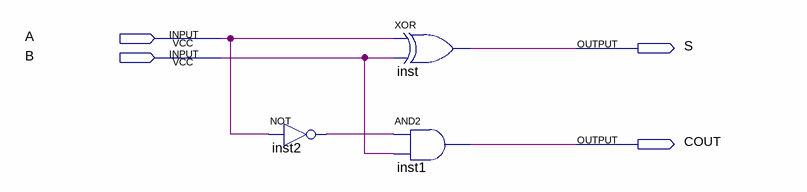
[diagram p0: schematic sheet]
// Quartus schematic MeioSubtrator.bdf as structural Verilog: 3 symbols, 4 pins
module MeioSubtrator (
  input  A,
  input  B,
  output S,
  output COUT
);

  wire inst2_out;

  not inst2 (inst2_out, A);
  xor inst (S, A, B);
  and inst1 (COUT, inst2_out, B);
endmodule
